# EasyEDA schematic Ground Station Electronics.json
TITLE: Ground Station Electronics; REV: 1.0; Date: 2024-07-28; Sheet: 1/1; Company: DART
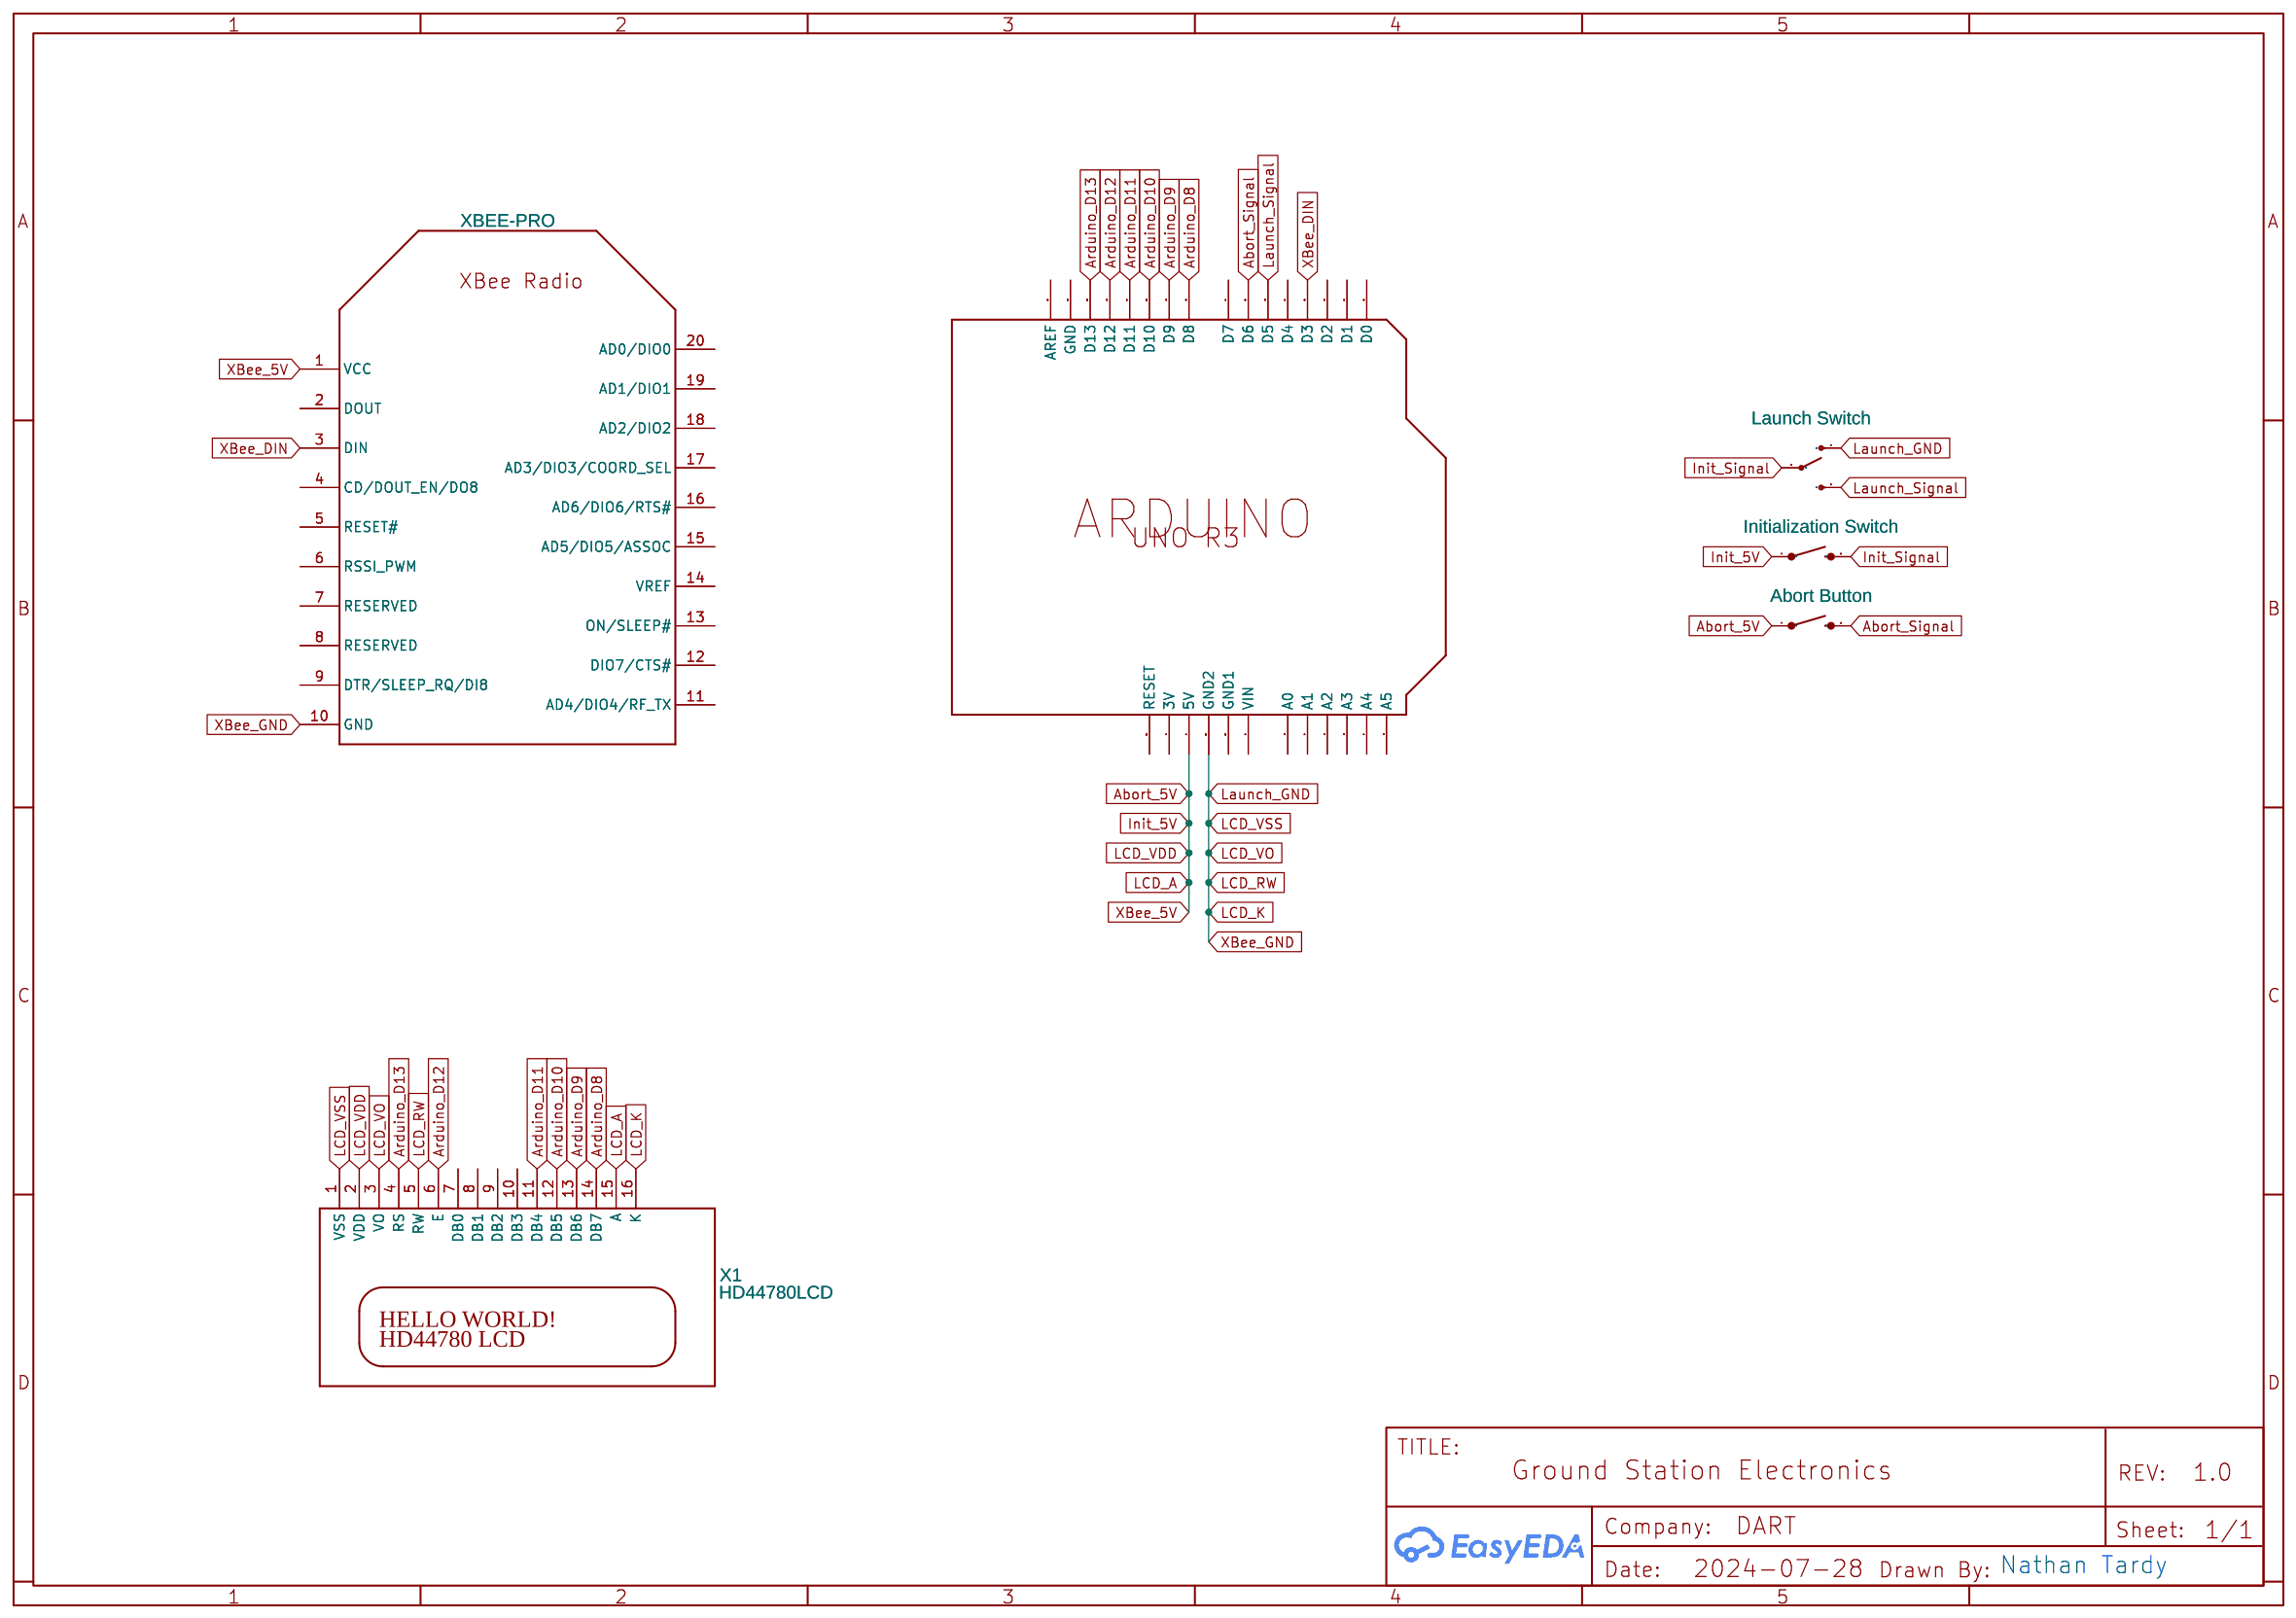
[diagram p0: schematic sheet]

## Parts
M1  XBEE-PRO  [XBEE-PRO]
S1  Initialization Switch  [TACTILE-SWITCH-SMD]
S2  Launch Switch  [SWITCHE-DPDT]
S3  Abort Button  [TACTILE-SWITCH-SMD]
U2  ARDUINOUNO  [ARDUINO]
X1  HD44780LCD  [LCD1602]

## Library data of the parts
M1 = XBEE-PRO: Contributor: JLuz1
S1 S3 = SWITCH-MOMENTARY-2SMD: Various NO switches- pushbuttons, reed, etc; Contributor: SparkFun
S2 = SWITCH-SPSTPTH2: SPST Switch; Contributor: Pinoccio
U2 = ARDUINOUNO: Arduino DiecimilaDuemilanove; Contributor: Adafruit
X1 = HD44780LCD: Contributor: Adafruit

## Nets
Abort_5V: M1.1(VCC) S1.1 S3.1 U2.5V X1.2(VDD) X1.15(A)
Abort_Signal: S3.3(2) U2.D6
Arduino_D8: U2.D8 X1.14(DB7)
Arduino_D9: U2.D9 X1.13(DB6)
Arduino_D10: U2.D10 X1.12(DB5)
Arduino_D11: U2.D11 X1.11(DB4)
Arduino_D12: U2.D12 X1.6(E)
Arduino_D13: U2.D13 X1.4(RS)
Init_Signal: S1.3(2) S2.2(P)
Launch_Signal: S2.3(S) U2.D5
LCD_K: M1.10(GND) S2.1(O) U2.GND2 X1.1(VSS) X1.3(VO) X1.5(RW) X1.16(K)
XBee_DIN: M1.3(DIN) U2.D3

Not connected (* = marked no-connect by the designer): M1 2(DOUT) 4(CD/DOUT_EN/DO8) 5(RESET#) 6(RSSI_PWM) 7(RESERVED) 8(RESERVED) 9(DTR/SLEEP_RQ/DI8) 11(AD4/DIO4/RF_TX) 12(DIO7/CTS#) 13(ON/SLEEP#) 14(VREF) 15(AD5/DIO5/ASSOC) 16(AD6/DIO6/RTS#) 17(AD3/DIO3/COORD_SEL) 18(AD2/DIO2) 19(AD1/DIO1) 20(AD0/DIO0); U2 3V A0 A1 A2 A3 A4 A5 AREF D0 D1 D2 D4 D7 GND GND1 RESET VIN; X1 7(DB0) 8(DB1) 9(DB2) 10(DB3)

## Notes on the sheet
- Nathan Tardy
